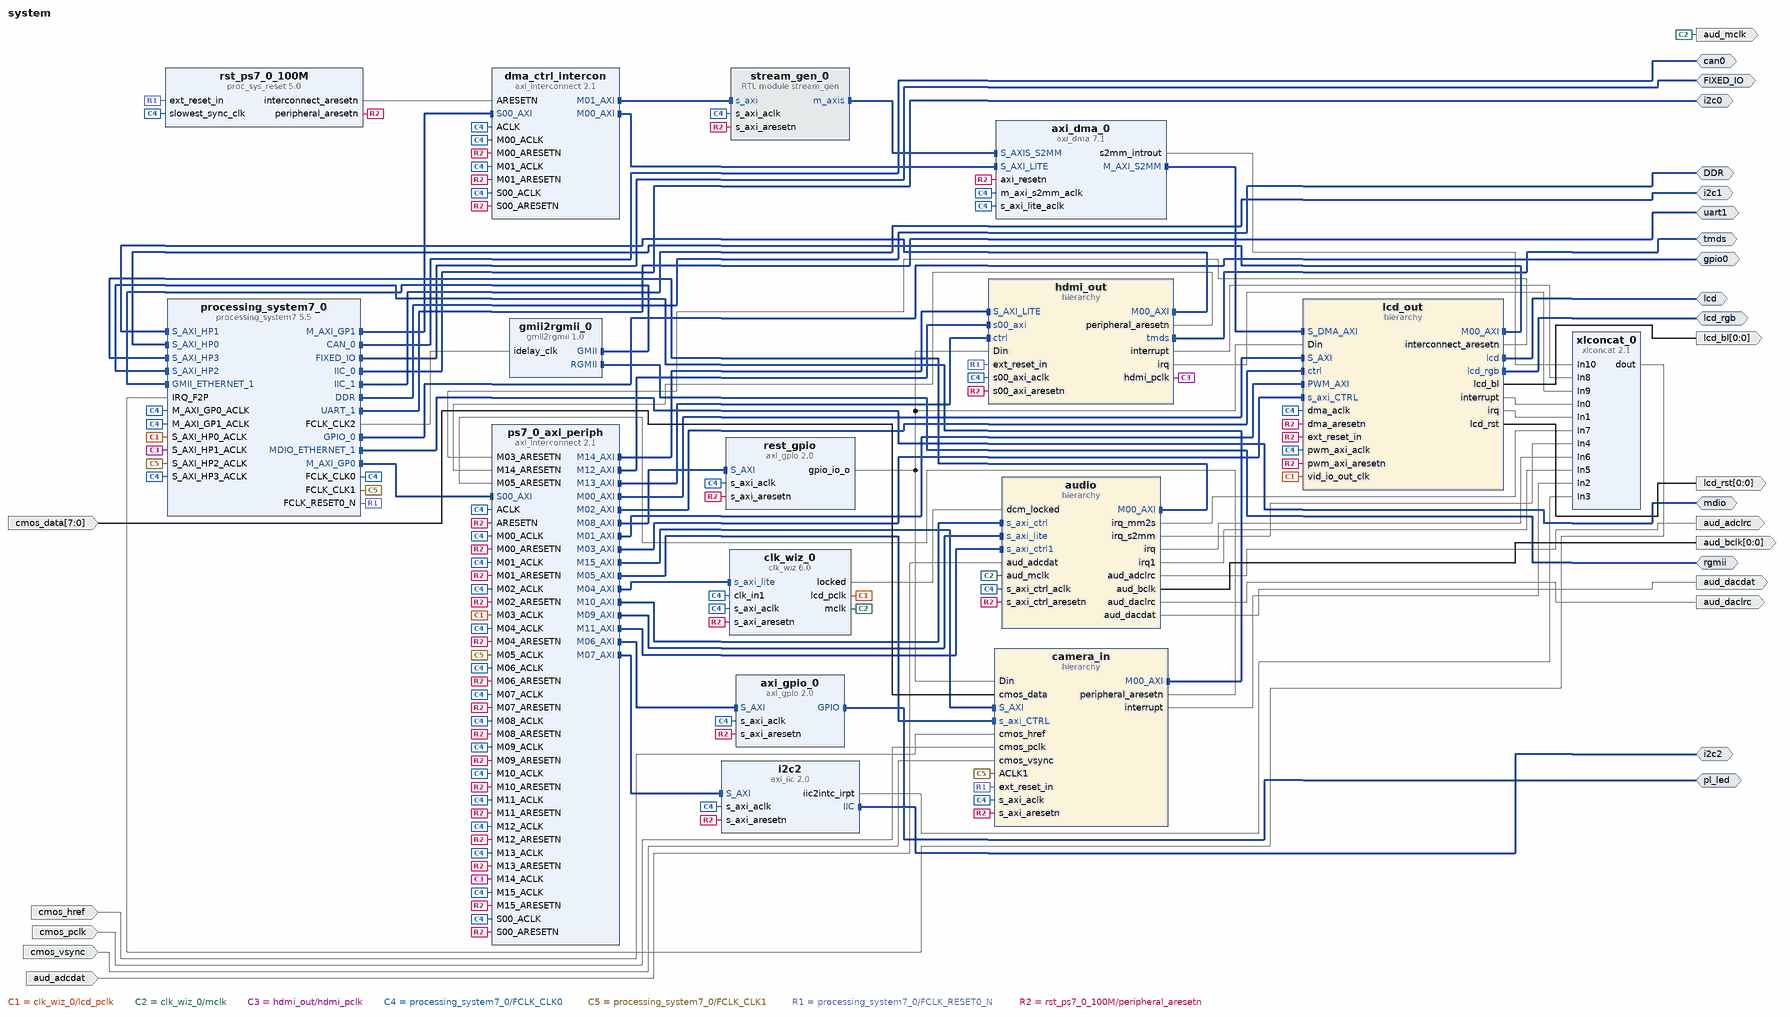
[diagram p0: block diagram of the top level]
# Vivado block design system, xc7z020clg400-2, Vivado 2020.2
create_bd_design system

create_bd_intf_port -mode Master -vlnv xilinx.com:interface:ddrx_rtl:1.0 DDR
create_bd_intf_port -mode Master -vlnv xilinx.com:display_processing_system7:fixedio_rtl:1.0 FIXED_IO
create_bd_intf_port -mode Master -vlnv xilinx.com:interface:can_rtl:1.0 can0
create_bd_intf_port -mode Master -vlnv xilinx.com:interface:gpio_rtl:1.0 gpio0
create_bd_intf_port -mode Master -vlnv xilinx.com:interface:iic_rtl:1.0 i2c0
create_bd_intf_port -mode Master -vlnv xilinx.com:interface:iic_rtl:1.0 i2c1
create_bd_intf_port -mode Master -vlnv xilinx.com:interface:iic_rtl:1.0 i2c2
create_bd_intf_port -mode Master -vlnv xilinx.com:user:lcd_rtl:1.0 lcd
create_bd_intf_port -mode Master -vlnv xilinx.com:interface:gpio_rtl:1.0 lcd_rgb
create_bd_intf_port -mode Master -vlnv xilinx.com:interface:mdio_rtl:1.0 mdio
create_bd_intf_port -mode Master -vlnv xilinx.com:interface:gpio_rtl:1.0 pl_led
create_bd_intf_port -mode Master -vlnv xilinx.com:interface:rgmii_rtl:1.0 rgmii
create_bd_intf_port -mode Master -vlnv openedv.com:user:TMDS_rtl:1.0 tmds
create_bd_intf_port -mode Master -vlnv xilinx.com:interface:uart_rtl:1.0 uart1
create_bd_port -dir I aud_adcdat
create_bd_port -dir O aud_adclrc
create_bd_port -dir O -from 0 -to 0 aud_bclk
create_bd_port -dir O aud_dacdat
create_bd_port -dir O aud_daclrc
create_bd_port -dir I -from 7 -to 0 cmos_data
create_bd_port -dir I cmos_href
create_bd_port -dir I cmos_pclk
create_bd_port -dir I cmos_vsync
create_bd_port -dir O -from 0 -to 0 lcd_bl
create_bd_port -dir O -from 0 -to 0 -type rst lcd_rst
create_bd_port -dir O -type clk aud_mclk

create_bd_cell -type hier audio
create_bd_cell -type ip -vlnv xilinx.com:ip:axi_gpio:2.0 axi_gpio_0
set_property -dict {CONFIG.C_ALL_OUTPUTS 1 CONFIG.C_GPIO_WIDTH 2} [get_bd_cells axi_gpio_0]
create_bd_cell -type hier camera_in
create_bd_cell -type ip -vlnv xilinx.com:ip:clk_wiz:6.0 clk_wiz_0
set_property -dict [list \
  CONFIG.CLKOUT1_DRIVES BUFG \
  CONFIG.CLKOUT1_JITTER 159.843 \
  CONFIG.CLKOUT1_PHASE_ERROR 94.994 \
  CONFIG.CLKOUT1_REQUESTED_OUT_FREQ 33.33333 \
  CONFIG.CLKOUT2_DRIVES BUFG \
  CONFIG.CLKOUT2_JITTER 183.032 \
  CONFIG.CLKOUT2_PHASE_ERROR 94.994 \
  CONFIG.CLKOUT2_REQUESTED_OUT_FREQ 16.9344 \
  CONFIG.CLKOUT2_USED true \
  CONFIG.CLKOUT3_DRIVES BUFG \
  CONFIG.CLKOUT4_DRIVES BUFG \
  CONFIG.CLKOUT5_DRIVES BUFG \
  CONFIG.CLKOUT6_DRIVES BUFG \
  CONFIG.CLKOUT7_DRIVES BUFG \
  CONFIG.CLK_OUT1_PORT lcd_pclk \
  CONFIG.CLK_OUT2_PORT mclk \
  CONFIG.MMCM_CLKFBOUT_MULT_F 10.500 \
  CONFIG.MMCM_CLKOUT0_DIVIDE_F 31.500 \
  CONFIG.MMCM_CLKOUT1_DIVIDE 62 \
  CONFIG.MMCM_DIVCLK_DIVIDE 1 \
  CONFIG.NUM_OUT_CLKS 2 \
  CONFIG.SECONDARY_SOURCE Single_ended_clock_capable_pin \
  CONFIG.USE_DYN_RECONFIG true \
  CONFIG.USE_PHASE_ALIGNMENT false \
] [get_bd_cells clk_wiz_0]
create_bd_cell -type ip -vlnv xilinx.com:user:gmii2rgmii:1.0 gmii2rgmii_0
create_bd_cell -type hier hdmi_out
create_bd_cell -type ip -vlnv xilinx.com:ip:axi_iic:2.0 i2c2
create_bd_cell -type hier lcd_out
create_bd_cell -type ip -vlnv xilinx.com:ip:processing_system7:5.5 processing_system7_0
set_property -dict [list \
  CONFIG.PCW_APU_PERIPHERAL_FREQMHZ 767.0 \
  CONFIG.PCW_CAN0_CAN0_IO EMIO \
  CONFIG.PCW_CAN0_PERIPHERAL_ENABLE 1 \
  CONFIG.PCW_ENET0_ENET0_IO {MIO 16 .. 27} \
  CONFIG.PCW_ENET0_GRP_MDIO_ENABLE 1 \
  CONFIG.PCW_ENET0_GRP_MDIO_IO {MIO 52 .. 53} \
  CONFIG.PCW_ENET0_PERIPHERAL_ENABLE 1 \
  CONFIG.PCW_ENET1_ENET1_IO EMIO \
  CONFIG.PCW_ENET1_GRP_MDIO_ENABLE 1 \
  CONFIG.PCW_ENET1_GRP_MDIO_IO EMIO \
  CONFIG.PCW_ENET1_PERIPHERAL_ENABLE 1 \
  CONFIG.PCW_ENET_RESET_ENABLE 0 \
  CONFIG.PCW_EN_CLK1_PORT 1 \
  CONFIG.PCW_EN_CLK2_PORT 1 \
  CONFIG.PCW_EN_CLK3_PORT 1 \
  CONFIG.PCW_FCLK1_PERIPHERAL_CLKSRC {ARM PLL} \
  CONFIG.PCW_FCLK3_PERIPHERAL_CLKSRC {ARM PLL} \
  CONFIG.PCW_FCLK_CLK1_BUF TRUE \
  CONFIG.PCW_FCLK_CLK2_BUF TRUE \
  CONFIG.PCW_FCLK_CLK3_BUF TRUE \
  CONFIG.PCW_FPGA0_PERIPHERAL_FREQMHZ 100.0 \
  CONFIG.PCW_FPGA1_PERIPHERAL_FREQMHZ 150 \
  CONFIG.PCW_FPGA2_PERIPHERAL_FREQMHZ 200.0 \
  CONFIG.PCW_FPGA3_PERIPHERAL_FREQMHZ 12 \
  CONFIG.PCW_FPGA_FCLK1_ENABLE 1 \
  CONFIG.PCW_FPGA_FCLK2_ENABLE 1 \
  CONFIG.PCW_FPGA_FCLK3_ENABLE 1 \
  CONFIG.PCW_GPIO_EMIO_GPIO_ENABLE 1 \
  CONFIG.PCW_GPIO_EMIO_GPIO_IO 11 \
  CONFIG.PCW_GPIO_EMIO_GPIO_WIDTH 11 \
  CONFIG.PCW_GPIO_MIO_GPIO_ENABLE 1 \
  CONFIG.PCW_GPIO_MIO_GPIO_IO MIO \
  CONFIG.PCW_I2C0_I2C0_IO EMIO \
  CONFIG.PCW_I2C0_PERIPHERAL_ENABLE 1 \
  CONFIG.PCW_I2C1_I2C1_IO EMIO \
  CONFIG.PCW_I2C1_PERIPHERAL_ENABLE 1 \
  CONFIG.PCW_I2C_PERIPHERAL_FREQMHZ 127.777779 \
  CONFIG.PCW_I2C_RESET_ENABLE 0 \
  CONFIG.PCW_IRQ_F2P_INTR 1 \
  CONFIG.PCW_PRESET_BANK1_VOLTAGE {LVCMOS 1.8V} \
  CONFIG.PCW_QSPI_GRP_SINGLE_SS_ENABLE 1 \
  CONFIG.PCW_QSPI_GRP_SINGLE_SS_IO {MIO 1 .. 6} \
  CONFIG.PCW_QSPI_PERIPHERAL_ENABLE 1 \
  CONFIG.PCW_QSPI_QSPI_IO {MIO 1 .. 6} \
  CONFIG.PCW_SD0_GRP_CD_ENABLE 1 \
  CONFIG.PCW_SD0_GRP_CD_IO {MIO 10} \
  CONFIG.PCW_SD0_GRP_WP_ENABLE 0 \
  CONFIG.PCW_SD0_PERIPHERAL_ENABLE 1 \
  CONFIG.PCW_SD0_SD0_IO {MIO 40 .. 45} \
  CONFIG.PCW_SD1_PERIPHERAL_ENABLE 1 \
  CONFIG.PCW_SD1_SD1_IO {MIO 46 .. 51} \
  CONFIG.PCW_SDIO_PERIPHERAL_FREQMHZ 100 \
  CONFIG.PCW_SINGLE_QSPI_DATA_MODE x4 \
  CONFIG.PCW_UART0_PERIPHERAL_ENABLE 1 \
  CONFIG.PCW_UART0_UART0_IO {MIO 14 .. 15} \
  CONFIG.PCW_UART1_PERIPHERAL_ENABLE 1 \
  CONFIG.PCW_UART1_UART1_IO EMIO \
  CONFIG.PCW_UART_PERIPHERAL_FREQMHZ 100 \
  CONFIG.PCW_UIPARAM_DDR_MEMORY_TYPE {DDR 3 (Low Voltage)} \
  CONFIG.PCW_UIPARAM_DDR_PARTNO {MT41K256M16 RE-125} \
  CONFIG.PCW_USB0_PERIPHERAL_ENABLE 1 \
  CONFIG.PCW_USB0_RESET_ENABLE 1 \
  CONFIG.PCW_USB0_RESET_IO {MIO 9} \
  CONFIG.PCW_USB0_USB0_IO {MIO 28 .. 39} \
  CONFIG.PCW_USB_RESET_ENABLE 1 \
  CONFIG.PCW_USB_RESET_SELECT {Share reset pin} \
  CONFIG.PCW_USE_FABRIC_INTERRUPT 1 \
  CONFIG.PCW_USE_M_AXI_GP1 1 \
  CONFIG.PCW_USE_S_AXI_HP0 1 \
  CONFIG.PCW_USE_S_AXI_HP1 1 \
  CONFIG.PCW_USE_S_AXI_HP2 1 \
  CONFIG.PCW_USE_S_AXI_HP3 1 \
] [get_bd_cells processing_system7_0]
# 230 more settings of processing_system7_0 are not shown: defaults, MIO pin electricals, DDR timing, and values the tool derives
create_bd_cell -type ip -vlnv xilinx.com:ip:axi_interconnect:2.1 ps7_0_axi_periph
set_property -dict {CONFIG.NUM_MI 16} [get_bd_cells ps7_0_axi_periph]
create_bd_cell -type ip -vlnv xilinx.com:ip:axi_gpio:2.0 rest_gpio
set_property -dict {CONFIG.C_ALL_OUTPUTS 1 CONFIG.C_GPIO_WIDTH 3} [get_bd_cells rest_gpio]
create_bd_cell -type ip -vlnv xilinx.com:ip:proc_sys_reset:5.0 rst_ps7_0_100M
create_bd_cell -type ip -vlnv xilinx.com:ip:xlconcat:2.1 xlconcat_0
set_property -dict {CONFIG.NUM_PORTS 11} [get_bd_cells xlconcat_0]
create_bd_cell -type module -reference stream_gen stream_gen_0
create_bd_cell -type ip -vlnv xilinx.com:ip:axi_dma:7.1 axi_dma_0
set_property -dict [list \
  CONFIG.c_include_mm2s 0 \
  CONFIG.c_include_s2mm 1 \
  CONFIG.c_include_sg 0 \
  CONFIG.c_sg_length_width 23 \
] [get_bd_cells axi_dma_0]
create_bd_cell -type ip -vlnv xilinx.com:ip:axi_interconnect:2.1 dma_ctrl_intercon
set_property -dict {CONFIG.NUM_MI 2 CONFIG.NUM_SI 1} [get_bd_cells dma_ctrl_intercon]

# ---- hierarchy /audio ----
current_bd_instance /audio
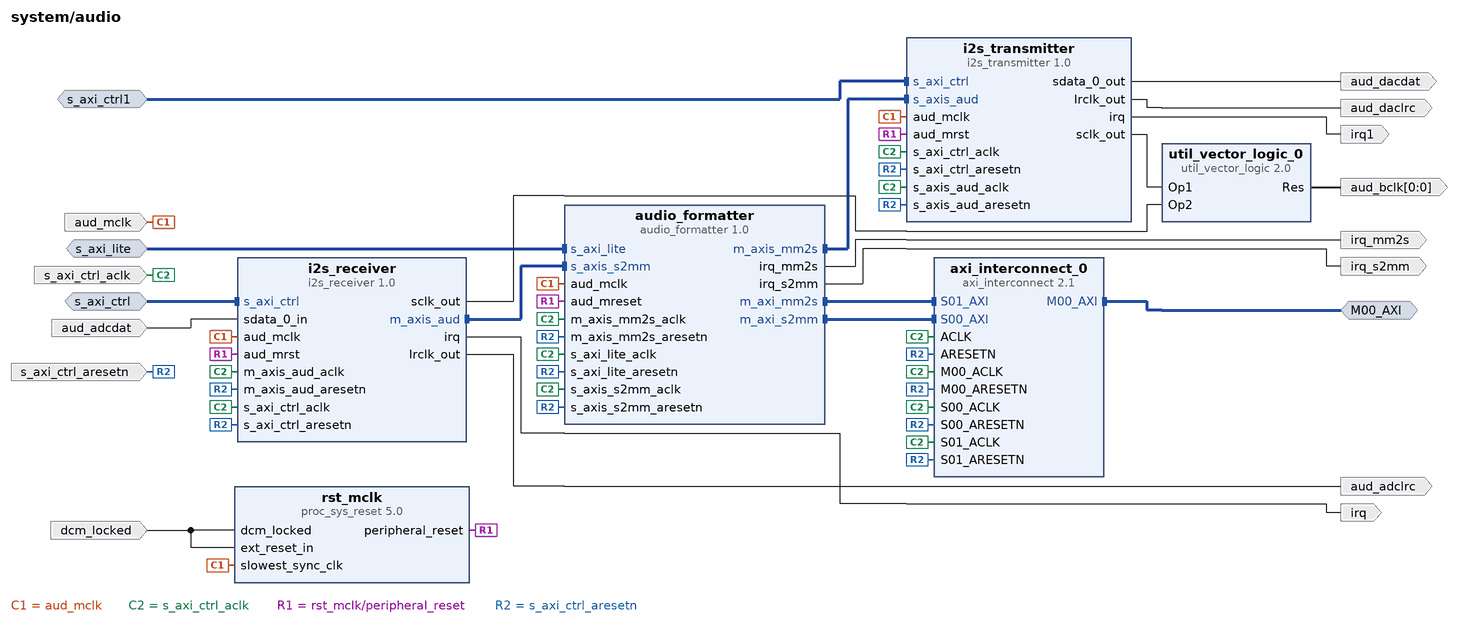
[diagram p1: block diagram inside /audio]
create_bd_intf_pin -mode Master -vlnv xilinx.com:interface:aximm_rtl:1.0 M00_AXI
create_bd_intf_pin -mode Slave -vlnv xilinx.com:interface:aximm_rtl:1.0 s_axi_ctrl
create_bd_intf_pin -mode Slave -vlnv xilinx.com:interface:aximm_rtl:1.0 s_axi_ctrl1
create_bd_intf_pin -mode Slave -vlnv xilinx.com:interface:aximm_rtl:1.0 s_axi_lite
create_bd_pin -dir I aud_adcdat
create_bd_pin -dir O aud_adclrc
create_bd_pin -dir O -from 0 -to 0 aud_bclk
create_bd_pin -dir O aud_dacdat
create_bd_pin -dir O aud_daclrc
create_bd_pin -dir I -type clk aud_mclk
create_bd_pin -dir I dcm_locked
create_bd_pin -dir O -type intr irq
create_bd_pin -dir O -type intr irq1
create_bd_pin -dir O -type intr irq_mm2s
create_bd_pin -dir O -type intr irq_s2mm
create_bd_pin -dir I -type clk s_axi_ctrl_aclk
create_bd_pin -dir I -type rst s_axi_ctrl_aresetn

create_bd_cell -type ip -vlnv xilinx.com:ip:audio_formatter:1.0 audio_formatter
set_property -dict [list \
  CONFIG.C_MM2S_ADDR_WIDTH 32 \
  CONFIG.C_MM2S_ASYNC_CLOCK 0 \
  CONFIG.C_S2MM_ADDR_WIDTH 32 \
  CONFIG.C_S2MM_ASYNC_CLOCK 0 \
] [get_bd_cells audio_formatter]
create_bd_cell -type ip -vlnv xilinx.com:ip:axi_interconnect:2.1 axi_interconnect_0
set_property -dict {CONFIG.NUM_MI 1 CONFIG.NUM_SI 2} [get_bd_cells axi_interconnect_0]
create_bd_cell -type ip -vlnv xilinx.com:ip:i2s_receiver:1.0 i2s_receiver
create_bd_cell -type ip -vlnv xilinx.com:ip:i2s_transmitter:1.0 i2s_transmitter
create_bd_cell -type ip -vlnv xilinx.com:ip:proc_sys_reset:5.0 rst_mclk
create_bd_cell -type ip -vlnv xilinx.com:ip:util_vector_logic:2.0 util_vector_logic_0
set_property -dict {CONFIG.C_OPERATION or CONFIG.C_SIZE 1} [get_bd_cells util_vector_logic_0]

# ---- hierarchy /camera_in ----
current_bd_instance /camera_in
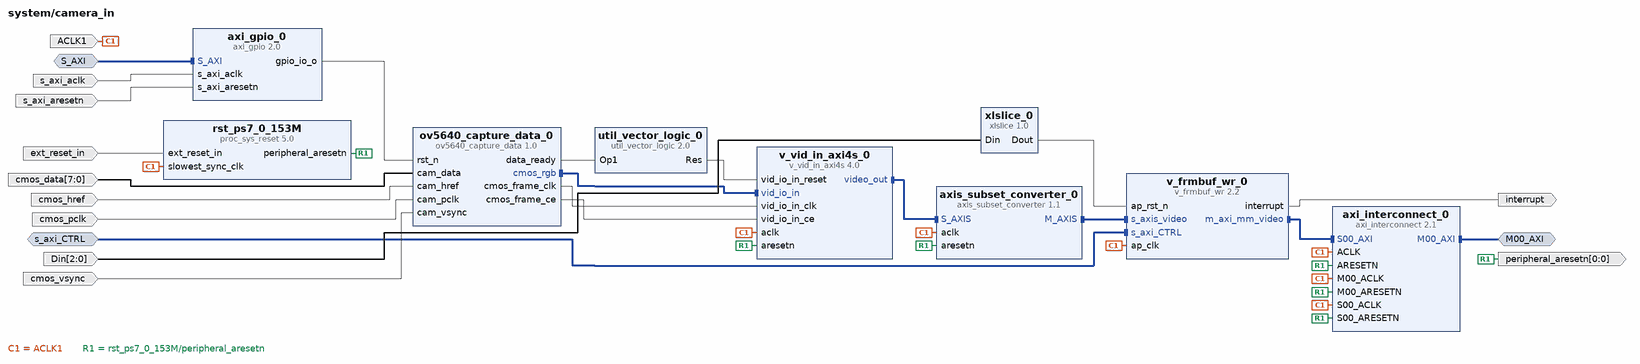
[diagram p2: block diagram inside /camera_in]
create_bd_intf_pin -mode Master -vlnv xilinx.com:interface:aximm_rtl:1.0 M00_AXI
create_bd_intf_pin -mode Slave -vlnv xilinx.com:interface:aximm_rtl:1.0 s_axi_CTRL
create_bd_intf_pin -mode Slave -vlnv xilinx.com:interface:aximm_rtl:1.0 S_AXI
create_bd_pin -dir I -type clk ACLK1
create_bd_pin -dir I -from 2 -to 0 Din
create_bd_pin -dir I -from 7 -to 0 cmos_data
create_bd_pin -dir I cmos_href
create_bd_pin -dir I cmos_pclk
create_bd_pin -dir I cmos_vsync
create_bd_pin -dir I -type rst ext_reset_in
create_bd_pin -dir O -type intr interrupt
create_bd_pin -dir O -from 0 -to 0 -type rst peripheral_aresetn
create_bd_pin -dir I -type clk s_axi_aclk
create_bd_pin -dir I -type rst s_axi_aresetn

create_bd_cell -type ip -vlnv xilinx.com:ip:axi_interconnect:2.1 axi_interconnect_0
set_property -dict {CONFIG.NUM_MI 1 CONFIG.S00_HAS_DATA_FIFO 2 CONFIG.S00_HAS_REGSLICE 4} [get_bd_cells axi_interconnect_0]
create_bd_cell -type ip -vlnv xilinx.com:ip:proc_sys_reset:5.0 rst_ps7_0_153M
create_bd_cell -type ip -vlnv xilinx.com:ip:v_frmbuf_wr:2.2 v_frmbuf_wr_0
set_property -dict [list \
  CONFIG.HAS_BGR8 1 \
  CONFIG.MAX_COLS 1920 \
  CONFIG.MAX_ROWS 1080 \
  CONFIG.SAMPLES_PER_CLOCK 1 \
] [get_bd_cells v_frmbuf_wr_0]
create_bd_cell -type ip -vlnv xilinx.com:ip:v_vid_in_axi4s:4.0 v_vid_in_axi4s_0
set_property -dict {CONFIG.C_ADDR_WIDTH 11 CONFIG.C_HAS_ASYNC_CLK 1} [get_bd_cells v_vid_in_axi4s_0]
create_bd_cell -type ip -vlnv xilinx.com:ip:xlslice:1.0 xlslice_0
set_property -dict {CONFIG.DIN_FROM 1 CONFIG.DIN_TO 1 CONFIG.DIN_WIDTH 3} [get_bd_cells xlslice_0]
create_bd_cell -type ip -vlnv xilinx.com:ip:axis_subset_converter:1.1 axis_subset_converter_0
set_property -dict [list \
  CONFIG.M_TDATA_NUM_BYTES 3 \
  CONFIG.S_TDATA_NUM_BYTES 3 \
  CONFIG.TDATA_REMAP {tdata[7:0],tdata[23:16],tdata[15:8]} \
] [get_bd_cells axis_subset_converter_0]
create_bd_cell -type ip -vlnv xilinx.com:ip:axi_gpio:2.0 axi_gpio_0
set_property -dict [list \
  CONFIG.C_ALL_INPUTS 0 \
  CONFIG.C_ALL_OUTPUTS 1 \
  CONFIG.C_GPIO_WIDTH 1 \
  CONFIG.C_IS_DUAL 0 \
] [get_bd_cells axi_gpio_0]
create_bd_cell -type ip -vlnv alientek.com:user:ov5640_capture_data:1.0 ov5640_capture_data_0
create_bd_cell -type ip -vlnv xilinx.com:ip:util_vector_logic:2.0 util_vector_logic_0
set_property -dict {CONFIG.C_OPERATION not CONFIG.C_SIZE 1} [get_bd_cells util_vector_logic_0]

# ---- hierarchy /hdmi_out ----
current_bd_instance /hdmi_out
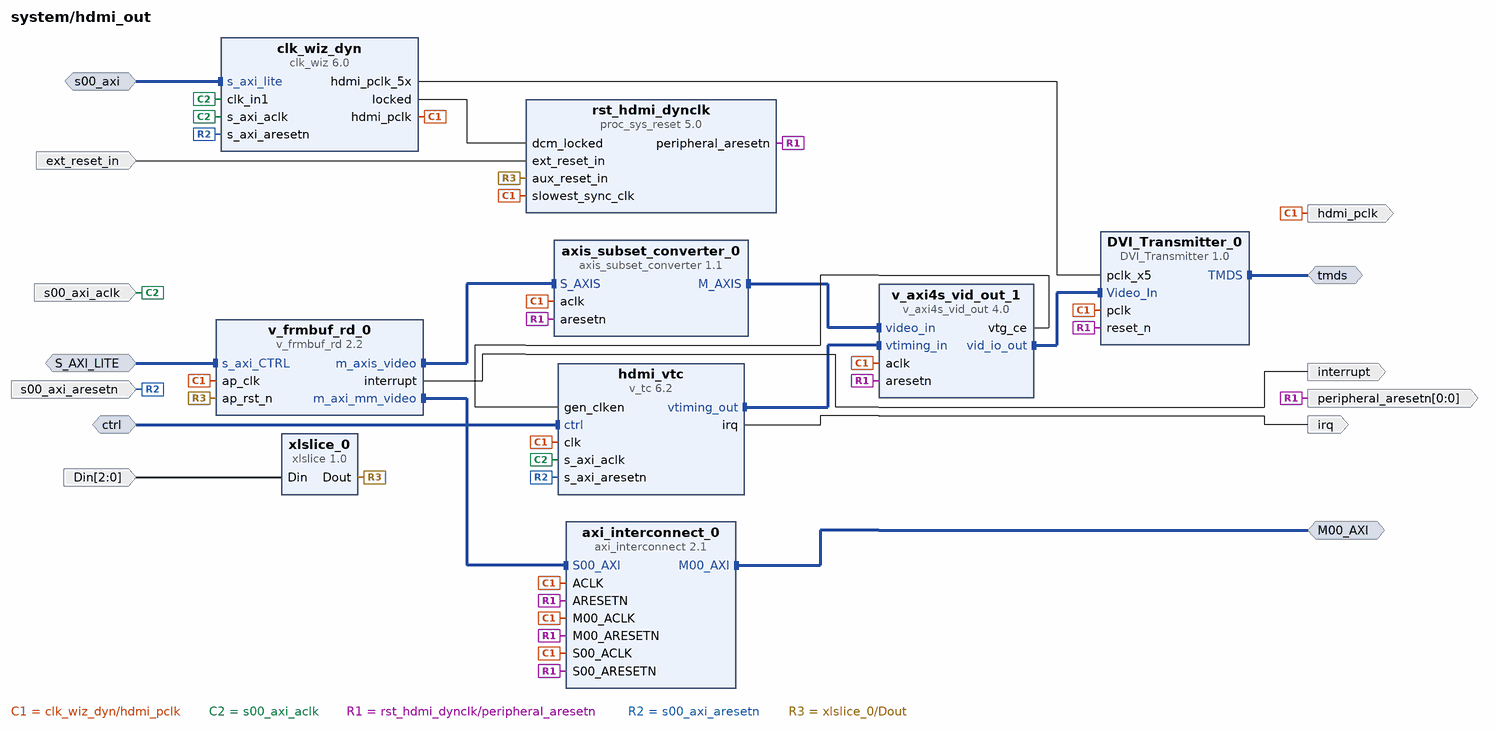
[diagram p3: block diagram inside /hdmi_out]
create_bd_intf_pin -mode Master -vlnv xilinx.com:interface:aximm_rtl:1.0 M00_AXI
create_bd_intf_pin -mode Slave -vlnv xilinx.com:interface:aximm_rtl:1.0 S_AXI_LITE
create_bd_intf_pin -mode Slave -vlnv xilinx.com:interface:aximm_rtl:1.0 ctrl
create_bd_intf_pin -mode Slave -vlnv xilinx.com:interface:aximm_rtl:1.0 s00_axi
create_bd_intf_pin -mode Master -vlnv openedv.com:user:TMDS_rtl:1.0 tmds
create_bd_pin -dir I -from 2 -to 0 Din
create_bd_pin -dir I -type rst ext_reset_in
create_bd_pin -dir O -type clk hdmi_pclk
create_bd_pin -dir O -type intr interrupt
create_bd_pin -dir O -type intr irq
create_bd_pin -dir O -from 0 -to 0 -type rst peripheral_aresetn
create_bd_pin -dir I -type clk s00_axi_aclk
create_bd_pin -dir I -type rst s00_axi_aresetn

create_bd_cell -type ip -vlnv openedv.com:user:DVI_Transmitter:1.0 DVI_Transmitter_0
create_bd_cell -type ip -vlnv xilinx.com:ip:axi_interconnect:2.1 axi_interconnect_0
set_property -dict [list \
  CONFIG.ENABLE_ADVANCED_OPTIONS 0 \
  CONFIG.NUM_MI 1 \
  CONFIG.S00_HAS_DATA_FIFO 0 \
  CONFIG.S00_HAS_REGSLICE 0 \
] [get_bd_cells axi_interconnect_0]
create_bd_cell -type ip -vlnv xilinx.com:ip:axis_subset_converter:1.1 axis_subset_converter_0
set_property -dict [list \
  CONFIG.M_TDATA_NUM_BYTES 3 \
  CONFIG.S_TDATA_NUM_BYTES 3 \
  CONFIG.TDATA_REMAP {tdata[15:8],tdata[7:0],tdata[23:16]} \
] [get_bd_cells axis_subset_converter_0]
create_bd_cell -type ip -vlnv xilinx.com:ip:clk_wiz:6.0 clk_wiz_dyn
set_property -dict [list \
  CONFIG.CLKOUT1_DRIVES BUFG \
  CONFIG.CLKOUT1_JITTER 298.245 \
  CONFIG.CLKOUT1_PHASE_ERROR 322.999 \
  CONFIG.CLKOUT1_REQUESTED_OUT_FREQ 148.5 \
  CONFIG.CLKOUT2_DRIVES No_buffer \
  CONFIG.CLKOUT2_JITTER 232.529 \
  CONFIG.CLKOUT2_PHASE_ERROR 322.999 \
  CONFIG.CLKOUT2_REQUESTED_OUT_FREQ 742.5 \
  CONFIG.CLKOUT2_USED true \
  CONFIG.CLKOUT3_DRIVES BUFG \
  CONFIG.CLKOUT4_DRIVES BUFG \
  CONFIG.CLKOUT5_DRIVES BUFG \
  CONFIG.CLKOUT6_DRIVES BUFG \
  CONFIG.CLKOUT7_DRIVES BUFG \
  CONFIG.CLK_OUT1_PORT hdmi_pclk \
  CONFIG.CLK_OUT2_PORT hdmi_pclk_5x \
  CONFIG.FEEDBACK_SOURCE FDBK_AUTO \
  CONFIG.MMCM_CLKFBOUT_MULT_F 37.125 \
  CONFIG.MMCM_CLKOUT0_DIVIDE_F 5.000 \
  CONFIG.MMCM_CLKOUT1_DIVIDE 1 \
  CONFIG.MMCM_DIVCLK_DIVIDE 5 \
  CONFIG.NUM_OUT_CLKS 2 \
  CONFIG.SECONDARY_SOURCE Single_ended_clock_capable_pin \
  CONFIG.USE_DYN_RECONFIG true \
  CONFIG.USE_PHASE_ALIGNMENT false \
] [get_bd_cells clk_wiz_dyn]
create_bd_cell -type ip -vlnv xilinx.com:ip:v_tc:6.2 hdmi_vtc
set_property -dict [list \
  CONFIG.VIDEO_MODE 1080p \
  CONFIG.enable_detection false \
  CONFIG.max_clocks_per_line 4096 \
  CONFIG.max_lines_per_frame 2048 \
] [get_bd_cells hdmi_vtc]
create_bd_cell -type ip -vlnv xilinx.com:ip:proc_sys_reset:5.0 rst_hdmi_dynclk
create_bd_cell -type ip -vlnv xilinx.com:ip:v_axi4s_vid_out:4.0 v_axi4s_vid_out_1
set_property -dict {CONFIG.C_ADDR_WIDTH 11 CONFIG.C_HAS_ASYNC_CLK 0} [get_bd_cells v_axi4s_vid_out_1]
create_bd_cell -type ip -vlnv xilinx.com:ip:v_frmbuf_rd:2.2 v_frmbuf_rd_0
set_property -dict [list \
  CONFIG.HAS_BGR8 1 \
  CONFIG.MAX_COLS 1920 \
  CONFIG.MAX_ROWS 1080 \
  CONFIG.SAMPLES_PER_CLOCK 1 \
] [get_bd_cells v_frmbuf_rd_0]
create_bd_cell -type ip -vlnv xilinx.com:ip:xlslice:1.0 xlslice_0
set_property -dict {CONFIG.DIN_FROM 2 CONFIG.DIN_TO 2 CONFIG.DIN_WIDTH 3} [get_bd_cells xlslice_0]

# ---- hierarchy /lcd_out ----
current_bd_instance /lcd_out
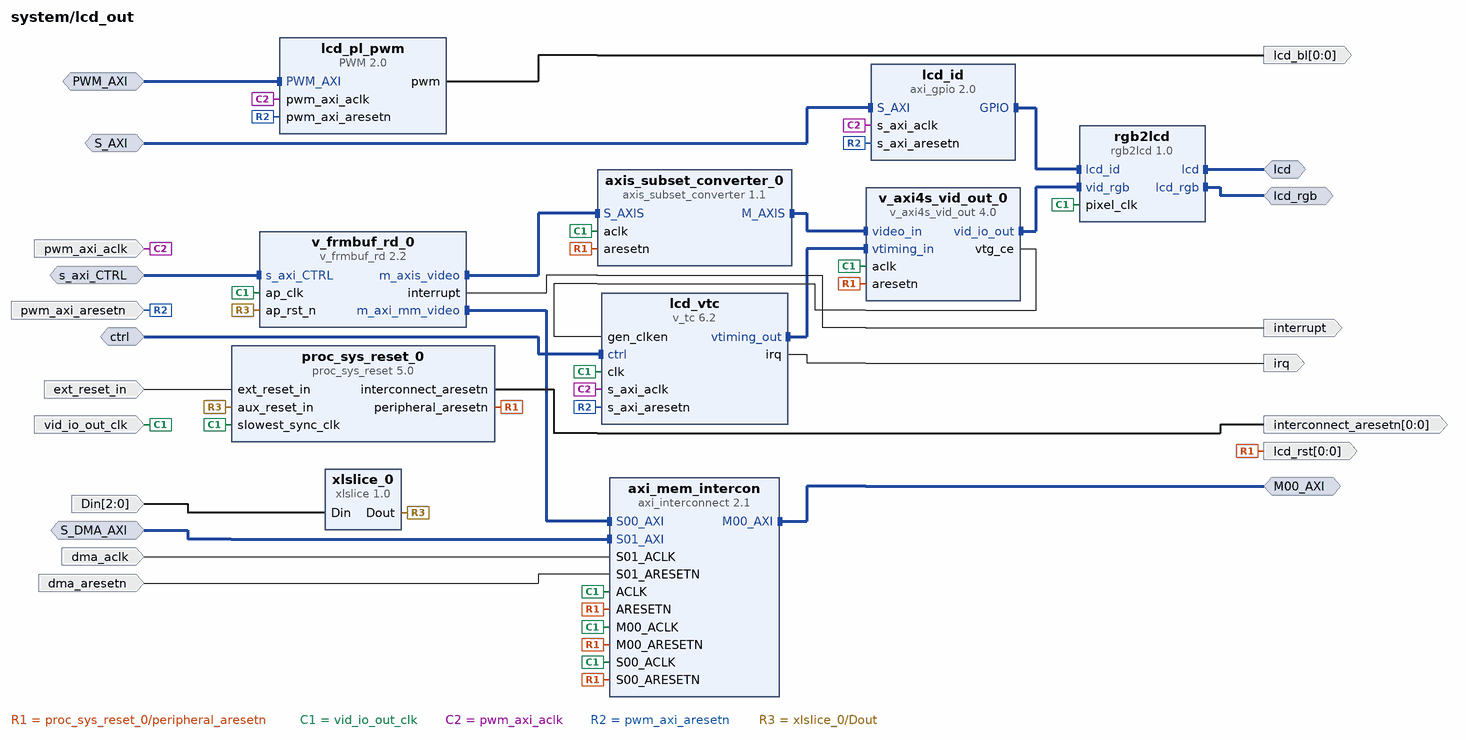
[diagram p4: block diagram inside /lcd_out]
create_bd_intf_pin -mode Master -vlnv xilinx.com:interface:aximm_rtl:1.0 M00_AXI
create_bd_intf_pin -mode Slave -vlnv xilinx.com:interface:aximm_rtl:1.0 PWM_AXI
create_bd_intf_pin -mode Slave -vlnv xilinx.com:interface:aximm_rtl:1.0 S_AXI
create_bd_intf_pin -mode Slave -vlnv xilinx.com:interface:aximm_rtl:1.0 ctrl
create_bd_intf_pin -mode Master -vlnv xilinx.com:user:lcd_rtl:1.0 lcd
create_bd_intf_pin -mode Master -vlnv xilinx.com:interface:gpio_rtl:1.0 lcd_rgb
create_bd_intf_pin -mode Slave -vlnv xilinx.com:interface:aximm_rtl:1.0 s_axi_CTRL
create_bd_intf_pin -mode Slave -vlnv xilinx.com:interface:aximm_rtl:1.0 S_DMA_AXI
create_bd_pin -dir I -from 2 -to 0 Din
create_bd_pin -dir I -type rst ext_reset_in
create_bd_pin -dir O -from 0 -to 0 -type rst interconnect_aresetn
create_bd_pin -dir O -type intr interrupt
create_bd_pin -dir O -type intr irq
create_bd_pin -dir O -from 0 -to 0 lcd_bl
create_bd_pin -dir O -from 0 -to 0 -type rst lcd_rst
create_bd_pin -dir I -type clk pwm_axi_aclk
create_bd_pin -dir I -type rst pwm_axi_aresetn
create_bd_pin -dir I -type clk vid_io_out_clk
create_bd_pin -dir I -type clk dma_aclk
create_bd_pin -dir I -type rst dma_aresetn

create_bd_cell -type ip -vlnv xilinx.com:ip:axi_interconnect:2.1 axi_mem_intercon
set_property -dict {CONFIG.NUM_MI 1 CONFIG.NUM_SI 2} [get_bd_cells axi_mem_intercon]
create_bd_cell -type ip -vlnv xilinx.com:ip:axi_gpio:2.0 lcd_id
set_property -dict {CONFIG.C_GPIO_WIDTH 3} [get_bd_cells lcd_id]
create_bd_cell -type ip -vlnv digilentinc.com:IP:PWM:2.0 lcd_pl_pwm
create_bd_cell -type ip -vlnv xilinx.com:ip:v_tc:6.2 lcd_vtc
set_property -dict [list \
  CONFIG.enable_detection false \
  CONFIG.max_clocks_per_line 2048 \
  CONFIG.max_lines_per_frame 2048 \
] [get_bd_cells lcd_vtc]
create_bd_cell -type ip -vlnv xilinx.com:ip:proc_sys_reset:5.0 proc_sys_reset_0
create_bd_cell -type ip -vlnv www.alientek.com:user:rgb2lcd:1.0 rgb2lcd
create_bd_cell -type ip -vlnv xilinx.com:ip:v_axi4s_vid_out:4.0 v_axi4s_vid_out_0
set_property -dict {CONFIG.C_ADDR_WIDTH 10 CONFIG.C_HAS_ASYNC_CLK 0} [get_bd_cells v_axi4s_vid_out_0]
create_bd_cell -type ip -vlnv xilinx.com:ip:v_frmbuf_rd:2.2 v_frmbuf_rd_0
set_property -dict [list \
  CONFIG.HAS_BGR8 1 \
  CONFIG.MAX_COLS 1920 \
  CONFIG.MAX_ROWS 1080 \
  CONFIG.SAMPLES_PER_CLOCK 1 \
] [get_bd_cells v_frmbuf_rd_0]
create_bd_cell -type ip -vlnv xilinx.com:ip:xlslice:1.0 xlslice_0
set_property -dict {CONFIG.DIN_WIDTH 3} [get_bd_cells xlslice_0]
create_bd_cell -type ip -vlnv xilinx.com:ip:axis_subset_converter:1.1 axis_subset_converter_0
set_property -dict [list \
  CONFIG.M_TDATA_NUM_BYTES 3 \
  CONFIG.S_TDATA_NUM_BYTES 3 \
  CONFIG.TDATA_REMAP {tdata[15:8],tdata[7:0],tdata[23:16]} \
] [get_bd_cells axis_subset_converter_0]

# ---- connections ----

current_bd_instance /audio
connect_bd_intf_net [get_bd_intf_pins M00_AXI] [get_bd_intf_pins axi_interconnect_0/M00_AXI]
connect_bd_intf_net [get_bd_intf_pins audio_formatter/s_axis_s2mm] [get_bd_intf_pins i2s_receiver/m_axis_aud]
connect_bd_intf_net [get_bd_intf_pins s_axi_ctrl1] [get_bd_intf_pins i2s_transmitter/s_axi_ctrl]
connect_bd_intf_net [get_bd_intf_pins s_axi_ctrl] [get_bd_intf_pins i2s_receiver/s_axi_ctrl]
connect_bd_intf_net [get_bd_intf_pins audio_formatter/m_axis_mm2s] [get_bd_intf_pins i2s_transmitter/s_axis_aud]
connect_bd_intf_net [get_bd_intf_pins audio_formatter/m_axi_mm2s] [get_bd_intf_pins axi_interconnect_0/S01_AXI]
connect_bd_intf_net [get_bd_intf_pins audio_formatter/m_axi_s2mm] [get_bd_intf_pins axi_interconnect_0/S00_AXI]
connect_bd_intf_net [get_bd_intf_pins s_axi_lite] [get_bd_intf_pins audio_formatter/s_axi_lite]
connect_bd_net [get_bd_pins audio_formatter/irq_mm2s] [get_bd_pins irq_mm2s]
connect_bd_net [get_bd_pins audio_formatter/irq_s2mm] [get_bd_pins irq_s2mm]
connect_bd_net -net clk_wiz_0_clk_out2 [get_bd_pins aud_mclk] \
  [get_bd_pins audio_formatter/aud_mclk] [get_bd_pins i2s_receiver/aud_mclk] [get_bd_pins i2s_transmitter/aud_mclk] \
  [get_bd_pins rst_mclk/slowest_sync_clk]
connect_bd_net [get_bd_pins dcm_locked] [get_bd_pins rst_mclk/dcm_locked] [get_bd_pins rst_mclk/ext_reset_in]
connect_bd_net [get_bd_pins i2s_receiver/irq] [get_bd_pins irq]
connect_bd_net [get_bd_pins i2s_receiver/lrclk_out] [get_bd_pins aud_adclrc]
connect_bd_net [get_bd_pins i2s_transmitter/irq] [get_bd_pins irq1]
connect_bd_net [get_bd_pins i2s_transmitter/lrclk_out] [get_bd_pins aud_daclrc]
connect_bd_net [get_bd_pins i2s_transmitter/sdata_0_out] [get_bd_pins aud_dacdat]
connect_bd_net -net processing_system7_0_FCLK_CLK0 [get_bd_pins s_axi_ctrl_aclk] \
  [get_bd_pins audio_formatter/m_axis_mm2s_aclk] [get_bd_pins audio_formatter/s_axi_lite_aclk] \
  [get_bd_pins audio_formatter/s_axis_s2mm_aclk] [get_bd_pins axi_interconnect_0/ACLK] \
  [get_bd_pins axi_interconnect_0/M00_ACLK] [get_bd_pins axi_interconnect_0/S00_ACLK] \
  [get_bd_pins axi_interconnect_0/S01_ACLK] [get_bd_pins i2s_receiver/m_axis_aud_aclk] \
  [get_bd_pins i2s_receiver/s_axi_ctrl_aclk] [get_bd_pins i2s_transmitter/s_axi_ctrl_aclk] \
  [get_bd_pins i2s_transmitter/s_axis_aud_aclk]
connect_bd_net -net rst_clk_wiz_0_16M_peripheral_reset [get_bd_pins rst_mclk/peripheral_reset] \
  [get_bd_pins audio_formatter/aud_mreset] [get_bd_pins i2s_receiver/aud_mrst] [get_bd_pins i2s_transmitter/aud_mrst]
connect_bd_net -net rst_ps7_0_100M_peripheral_aresetn [get_bd_pins s_axi_ctrl_aresetn] \
  [get_bd_pins audio_formatter/m_axis_mm2s_aresetn] [get_bd_pins audio_formatter/s_axi_lite_aresetn] \
  [get_bd_pins audio_formatter/s_axis_s2mm_aresetn] [get_bd_pins axi_interconnect_0/ARESETN] \
  [get_bd_pins axi_interconnect_0/M00_ARESETN] [get_bd_pins axi_interconnect_0/S00_ARESETN] \
  [get_bd_pins axi_interconnect_0/S01_ARESETN] [get_bd_pins i2s_receiver/m_axis_aud_aresetn] \
  [get_bd_pins i2s_receiver/s_axi_ctrl_aresetn] [get_bd_pins i2s_transmitter/s_axi_ctrl_aresetn] \
  [get_bd_pins i2s_transmitter/s_axis_aud_aresetn]
connect_bd_net -net sdata_0_in_0_1 [get_bd_pins aud_adcdat] [get_bd_pins i2s_receiver/sdata_0_in]
connect_bd_net [get_bd_pins i2s_transmitter/sclk_out] [get_bd_pins util_vector_logic_0/Op1]
connect_bd_net [get_bd_pins i2s_receiver/sclk_out] [get_bd_pins util_vector_logic_0/Op2]
connect_bd_net [get_bd_pins util_vector_logic_0/Res] [get_bd_pins aud_bclk]

current_bd_instance /camera_in
connect_bd_intf_net [get_bd_intf_pins ov5640_capture_data_0/cmos_rgb] [get_bd_intf_pins v_vid_in_axi4s_0/vid_io_in]
connect_bd_intf_net [get_bd_intf_pins axis_subset_converter_0/M_AXIS] [get_bd_intf_pins v_frmbuf_wr_0/s_axis_video]
connect_bd_intf_net [get_bd_intf_pins v_vid_in_axi4s_0/video_out] [get_bd_intf_pins axis_subset_converter_0/S_AXIS]
connect_bd_intf_net [get_bd_intf_pins axi_interconnect_0/S00_AXI] [get_bd_intf_pins v_frmbuf_wr_0/m_axi_mm_video]
connect_bd_intf_net [get_bd_intf_pins S_AXI] [get_bd_intf_pins axi_gpio_0/S_AXI]
connect_bd_intf_net [get_bd_intf_pins s_axi_CTRL] [get_bd_intf_pins v_frmbuf_wr_0/s_axi_CTRL]
connect_bd_intf_net [get_bd_intf_pins M00_AXI] [get_bd_intf_pins axi_interconnect_0/M00_AXI]
connect_bd_net [get_bd_pins ACLK1] \
  [get_bd_pins axi_interconnect_0/ACLK] [get_bd_pins axi_interconnect_0/M00_ACLK] [get_bd_pins axi_interconnect_0/S00_ACLK] \
  [get_bd_pins rst_ps7_0_153M/slowest_sync_clk] [get_bd_pins v_frmbuf_wr_0/ap_clk] [get_bd_pins v_vid_in_axi4s_0/aclk] \
  [get_bd_pins axis_subset_converter_0/aclk]
connect_bd_net [get_bd_pins Din] [get_bd_pins xlslice_0/Din]
connect_bd_net [get_bd_pins ext_reset_in] [get_bd_pins rst_ps7_0_153M/ext_reset_in]
connect_bd_net [get_bd_pins rst_ps7_0_153M/peripheral_aresetn] \
  [get_bd_pins peripheral_aresetn] [get_bd_pins axi_interconnect_0/ARESETN] [get_bd_pins axi_interconnect_0/M00_ARESETN] \
  [get_bd_pins axi_interconnect_0/S00_ARESETN] [get_bd_pins v_vid_in_axi4s_0/aresetn] \
  [get_bd_pins axis_subset_converter_0/aresetn]
connect_bd_net [get_bd_pins v_frmbuf_wr_0/interrupt] [get_bd_pins interrupt]
connect_bd_net [get_bd_pins xlslice_0/Dout] [get_bd_pins v_frmbuf_wr_0/ap_rst_n]
connect_bd_net [get_bd_pins s_axi_aclk] [get_bd_pins axi_gpio_0/s_axi_aclk]
connect_bd_net [get_bd_pins s_axi_aresetn] [get_bd_pins axi_gpio_0/s_axi_aresetn]
connect_bd_net [get_bd_pins cmos_data] [get_bd_pins ov5640_capture_data_0/cam_data]
connect_bd_net [get_bd_pins cmos_href] [get_bd_pins ov5640_capture_data_0/cam_href]
connect_bd_net [get_bd_pins cmos_pclk] [get_bd_pins ov5640_capture_data_0/cam_pclk]
connect_bd_net [get_bd_pins cmos_vsync] [get_bd_pins ov5640_capture_data_0/cam_vsync]
connect_bd_net [get_bd_pins ov5640_capture_data_0/cmos_frame_clk] [get_bd_pins v_vid_in_axi4s_0/vid_io_in_clk]
connect_bd_net [get_bd_pins ov5640_capture_data_0/cmos_frame_ce] [get_bd_pins v_vid_in_axi4s_0/vid_io_in_ce]
connect_bd_net -net axi_gpio_1_gpio_io_o [get_bd_pins axi_gpio_0/gpio_io_o] [get_bd_pins ov5640_capture_data_0/rst_n]
connect_bd_net [get_bd_pins ov5640_capture_data_0/data_ready] [get_bd_pins util_vector_logic_0/Op1]
connect_bd_net [get_bd_pins util_vector_logic_0/Res] [get_bd_pins v_vid_in_axi4s_0/vid_io_in_reset]

current_bd_instance /hdmi_out
connect_bd_intf_net [get_bd_intf_pins S_AXI_LITE] [get_bd_intf_pins v_frmbuf_rd_0/s_axi_CTRL]
connect_bd_intf_net [get_bd_intf_pins tmds] [get_bd_intf_pins DVI_Transmitter_0/TMDS]
connect_bd_intf_net [get_bd_intf_pins axis_subset_converter_0/M_AXIS] [get_bd_intf_pins v_axi4s_vid_out_1/video_in]
connect_bd_intf_net [get_bd_intf_pins axi_interconnect_0/S00_AXI] [get_bd_intf_pins v_frmbuf_rd_0/m_axi_mm_video]
connect_bd_intf_net [get_bd_intf_pins s00_axi] [get_bd_intf_pins clk_wiz_dyn/s_axi_lite]
connect_bd_intf_net [get_bd_intf_pins axis_subset_converter_0/S_AXIS] [get_bd_intf_pins v_frmbuf_rd_0/m_axis_video]
connect_bd_intf_net [get_bd_intf_pins hdmi_vtc/vtiming_out] [get_bd_intf_pins v_axi4s_vid_out_1/vtiming_in]
connect_bd_intf_net [get_bd_intf_pins DVI_Transmitter_0/Video_In] [get_bd_intf_pins v_axi4s_vid_out_1/vid_io_out]
connect_bd_intf_net [get_bd_intf_pins M00_AXI] [get_bd_intf_pins axi_interconnect_0/M00_AXI]
connect_bd_intf_net [get_bd_intf_pins ctrl] [get_bd_intf_pins hdmi_vtc/ctrl]
connect_bd_net [get_bd_pins Din] [get_bd_pins xlslice_0/Din]
connect_bd_net -net clk_wiz_0_hdmi_pclk_5x [get_bd_pins clk_wiz_dyn/hdmi_pclk_5x] [get_bd_pins DVI_Transmitter_0/pclk_x5]
connect_bd_net -net clk_wiz_0_locked [get_bd_pins clk_wiz_dyn/locked] [get_bd_pins rst_hdmi_dynclk/dcm_locked]
connect_bd_net [get_bd_pins ext_reset_in] [get_bd_pins rst_hdmi_dynclk/ext_reset_in]
connect_bd_net -net hdmi_dynclk_PXL_CLK_O [get_bd_pins clk_wiz_dyn/hdmi_pclk] \
  [get_bd_pins hdmi_pclk] [get_bd_pins DVI_Transmitter_0/pclk] [get_bd_pins axi_interconnect_0/M00_ACLK] \
  [get_bd_pins axi_interconnect_0/S00_ACLK] [get_bd_pins axis_subset_converter_0/aclk] [get_bd_pins hdmi_vtc/clk] \
  [get_bd_pins rst_hdmi_dynclk/slowest_sync_clk] [get_bd_pins v_axi4s_vid_out_1/aclk] [get_bd_pins v_frmbuf_rd_0/ap_clk] \
  [get_bd_pins axi_interconnect_0/ACLK]
connect_bd_net [get_bd_pins hdmi_vtc/irq] [get_bd_pins irq]
connect_bd_net -net processing_system7_0_FCLK_CLK0 [get_bd_pins s00_axi_aclk] \
  [get_bd_pins clk_wiz_dyn/clk_in1] [get_bd_pins clk_wiz_dyn/s_axi_aclk] [get_bd_pins hdmi_vtc/s_axi_aclk]
connect_bd_net -net rst_hdmi_dynclk_100M_peripheral_aresetn [get_bd_pins rst_hdmi_dynclk/peripheral_aresetn] \
  [get_bd_pins peripheral_aresetn] [get_bd_pins DVI_Transmitter_0/reset_n] [get_bd_pins axi_interconnect_0/M00_ARESETN] \
  [get_bd_pins axi_interconnect_0/S00_ARESETN] [get_bd_pins axis_subset_converter_0/aresetn] \
  [get_bd_pins v_axi4s_vid_out_1/aresetn] [get_bd_pins axi_interconnect_0/ARESETN]
connect_bd_net -net rst_ps7_0_100M_peripheral_aresetn [get_bd_pins s00_axi_aresetn] \
  [get_bd_pins clk_wiz_dyn/s_axi_aresetn] [get_bd_pins hdmi_vtc/s_axi_aresetn]
connect_bd_net [get_bd_pins v_axi4s_vid_out_1/vtg_ce] [get_bd_pins hdmi_vtc/gen_clken]
connect_bd_net [get_bd_pins v_frmbuf_rd_0/interrupt] [get_bd_pins interrupt]
connect_bd_net [get_bd_pins xlslice_0/Dout] [get_bd_pins rst_hdmi_dynclk/aux_reset_in] [get_bd_pins v_frmbuf_rd_0/ap_rst_n]

current_bd_instance /lcd_out
connect_bd_intf_net [get_bd_intf_pins S_DMA_AXI] [get_bd_intf_pins axi_mem_intercon/S01_AXI]
connect_bd_intf_net [get_bd_intf_pins PWM_AXI] [get_bd_intf_pins lcd_pl_pwm/PWM_AXI]
connect_bd_intf_net [get_bd_intf_pins S_AXI] [get_bd_intf_pins lcd_id/S_AXI]
connect_bd_intf_net -intf_net rgb2lcd_1_lcd_rgb [get_bd_intf_pins lcd_rgb] [get_bd_intf_pins rgb2lcd/lcd_rgb]
connect_bd_intf_net [get_bd_intf_pins s_axi_CTRL] [get_bd_intf_pins v_frmbuf_rd_0/s_axi_CTRL]
connect_bd_intf_net [get_bd_intf_pins rgb2lcd/vid_rgb] [get_bd_intf_pins v_axi4s_vid_out_0/vid_io_out]
connect_bd_intf_net [get_bd_intf_pins axis_subset_converter_0/M_AXIS] [get_bd_intf_pins v_axi4s_vid_out_0/video_in]
connect_bd_intf_net [get_bd_intf_pins v_frmbuf_rd_0/m_axis_video] [get_bd_intf_pins axis_subset_converter_0/S_AXIS]
connect_bd_intf_net [get_bd_intf_pins ctrl] [get_bd_intf_pins lcd_vtc/ctrl]
connect_bd_intf_net [get_bd_intf_pins M00_AXI] [get_bd_intf_pins axi_mem_intercon/M00_AXI]
connect_bd_intf_net [get_bd_intf_pins axi_mem_intercon/S00_AXI] [get_bd_intf_pins v_frmbuf_rd_0/m_axi_mm_video]
connect_bd_intf_net [get_bd_intf_pins lcd_vtc/vtiming_out] [get_bd_intf_pins v_axi4s_vid_out_0/vtiming_in]
connect_bd_intf_net -intf_net gpio1_GPIO [get_bd_intf_pins lcd_id/GPIO] [get_bd_intf_pins rgb2lcd/lcd_id]
connect_bd_intf_net -intf_net rgb2lcd_1_lcd [get_bd_intf_pins lcd] [get_bd_intf_pins rgb2lcd/lcd]
connect_bd_net [get_bd_pins Din] [get_bd_pins xlslice_0/Din]
connect_bd_net -net ap_rst_n_1 [get_bd_pins proc_sys_reset_0/peripheral_aresetn] \
  [get_bd_pins lcd_rst] [get_bd_pins axi_mem_intercon/ARESETN] [get_bd_pins axi_mem_intercon/M00_ARESETN] \
  [get_bd_pins axi_mem_intercon/S00_ARESETN] [get_bd_pins v_axi4s_vid_out_0/aresetn] \
  [get_bd_pins axis_subset_converter_0/aresetn]
connect_bd_net -net clk_wiz_0_clk_out1 [get_bd_pins vid_io_out_clk] \
  [get_bd_pins axi_mem_intercon/ACLK] [get_bd_pins axi_mem_intercon/M00_ACLK] [get_bd_pins axi_mem_intercon/S00_ACLK] \
  [get_bd_pins lcd_vtc/clk] [get_bd_pins proc_sys_reset_0/slowest_sync_clk] [get_bd_pins rgb2lcd/pixel_clk] \
  [get_bd_pins v_axi4s_vid_out_0/aclk] [get_bd_pins v_frmbuf_rd_0/ap_clk] [get_bd_pins axis_subset_converter_0/aclk]
connect_bd_net [get_bd_pins ext_reset_in] [get_bd_pins proc_sys_reset_0/ext_reset_in]
connect_bd_net [get_bd_pins lcd_vtc/irq] [get_bd_pins irq]
connect_bd_net [get_bd_pins proc_sys_reset_0/interconnect_aresetn] [get_bd_pins interconnect_aresetn]
connect_bd_net -net processing_system7_0_FCLK_CLK0 [get_bd_pins pwm_axi_aclk] \
  [get_bd_pins lcd_id/s_axi_aclk] [get_bd_pins lcd_pl_pwm/pwm_axi_aclk] [get_bd_pins lcd_vtc/s_axi_aclk]
connect_bd_net -net pwm_0_pwm [get_bd_pins lcd_pl_pwm/pwm] [get_bd_pins lcd_bl]
connect_bd_net -net rst_ps7_0_100M_peripheral_aresetn [get_bd_pins pwm_axi_aresetn] \
  [get_bd_pins lcd_id/s_axi_aresetn] [get_bd_pins lcd_pl_pwm/pwm_axi_aresetn] [get_bd_pins lcd_vtc/s_axi_aresetn]
connect_bd_net [get_bd_pins v_axi4s_vid_out_0/vtg_ce] [get_bd_pins lcd_vtc/gen_clken]
connect_bd_net [get_bd_pins v_frmbuf_rd_0/interrupt] [get_bd_pins interrupt]
connect_bd_net [get_bd_pins xlslice_0/Dout] [get_bd_pins proc_sys_reset_0/aux_reset_in] [get_bd_pins v_frmbuf_rd_0/ap_rst_n]
connect_bd_net [get_bd_pins dma_aclk] [get_bd_pins axi_mem_intercon/S01_ACLK]
connect_bd_net [get_bd_pins dma_aresetn] [get_bd_pins axi_mem_intercon/S01_ARESETN]

current_bd_instance /
connect_bd_intf_net [get_bd_intf_pins axi_dma_0/M_AXI_S2MM] [get_bd_intf_pins lcd_out/S_DMA_AXI]
connect_bd_intf_net [get_bd_intf_pins audio/M00_AXI] [get_bd_intf_pins processing_system7_0/S_AXI_HP3]
connect_bd_intf_net [get_bd_intf_ports can0] [get_bd_intf_pins processing_system7_0/CAN_0]
connect_bd_intf_net [get_bd_intf_ports FIXED_IO] [get_bd_intf_pins processing_system7_0/FIXED_IO]
connect_bd_intf_net -intf_net rgb2lcd_1_lcd [get_bd_intf_ports lcd] [get_bd_intf_pins lcd_out/lcd]
connect_bd_intf_net [get_bd_intf_pins camera_in/M00_AXI] [get_bd_intf_pins processing_system7_0/S_AXI_HP2]
connect_bd_intf_net [get_bd_intf_ports i2c0] [get_bd_intf_pins processing_system7_0/IIC_0]
connect_bd_intf_net [get_bd_intf_pins hdmi_out/M00_AXI] [get_bd_intf_pins processing_system7_0/S_AXI_HP1]
connect_bd_intf_net [get_bd_intf_pins audio/s_axi_ctrl] [get_bd_intf_pins ps7_0_axi_periph/M10_AXI]
connect_bd_intf_net [get_bd_intf_ports pl_led] [get_bd_intf_pins axi_gpio_0/GPIO]
connect_bd_intf_net [get_bd_intf_pins ps7_0_axi_periph/M15_AXI] [get_bd_intf_pins camera_in/S_AXI]
connect_bd_intf_net [get_bd_intf_ports i2c2] [get_bd_intf_pins i2c2/IIC]
connect_bd_intf_net [get_bd_intf_ports i2c1] [get_bd_intf_pins processing_system7_0/IIC_1]
connect_bd_intf_net [get_bd_intf_pins lcd_out/S_AXI] [get_bd_intf_pins ps7_0_axi_periph/M00_AXI]
connect_bd_intf_net [get_bd_intf_pins lcd_out/ctrl] [get_bd_intf_pins ps7_0_axi_periph/M02_AXI]
connect_bd_intf_net [get_bd_intf_ports DDR] [get_bd_intf_pins processing_system7_0/DDR]
connect_bd_intf_net [get_bd_intf_pins gmii2rgmii_0/GMII] [get_bd_intf_pins processing_system7_0/GMII_ETHERNET_1]
connect_bd_intf_net [get_bd_intf_pins lcd_out/M00_AXI] [get_bd_intf_pins processing_system7_0/S_AXI_HP0]
connect_bd_intf_net [get_bd_intf_pins audio/s_axi_lite] [get_bd_intf_pins ps7_0_axi_periph/M09_AXI]
connect_bd_intf_net [get_bd_intf_pins hdmi_out/S_AXI_LITE] [get_bd_intf_pins ps7_0_axi_periph/M14_AXI]
connect_bd_intf_net [get_bd_intf_pins hdmi_out/s00_axi] [get_bd_intf_pins ps7_0_axi_periph/M12_AXI]
connect_bd_intf_net [get_bd_intf_pins camera_in/s_axi_CTRL] [get_bd_intf_pins ps7_0_axi_periph/M05_AXI]
connect_bd_intf_net [get_bd_intf_pins hdmi_out/ctrl] [get_bd_intf_pins ps7_0_axi_periph/M13_AXI]
connect_bd_intf_net [get_bd_intf_ports uart1] [get_bd_intf_pins processing_system7_0/UART_1]
connect_bd_intf_net -intf_net rgb2lcd_1_lcd_rgb [get_bd_intf_ports lcd_rgb] [get_bd_intf_pins lcd_out/lcd_rgb]
connect_bd_intf_net -intf_net DVI_Transmitter_0_TMDS [get_bd_intf_ports tmds] [get_bd_intf_pins hdmi_out/tmds]
connect_bd_intf_net [get_bd_intf_pins lcd_out/PWM_AXI] [get_bd_intf_pins ps7_0_axi_periph/M01_AXI]
connect_bd_intf_net [get_bd_intf_pins lcd_out/s_axi_CTRL] [get_bd_intf_pins ps7_0_axi_periph/M03_AXI]
connect_bd_intf_net [get_bd_intf_ports gpio0] [get_bd_intf_pins processing_system7_0/GPIO_0]
connect_bd_intf_net [get_bd_intf_pins ps7_0_axi_periph/M08_AXI] [get_bd_intf_pins rest_gpio/S_AXI]
connect_bd_intf_net [get_bd_intf_ports rgmii] [get_bd_intf_pins gmii2rgmii_0/RGMII]
connect_bd_intf_net [get_bd_intf_pins i2c2/S_AXI] [get_bd_intf_pins ps7_0_axi_periph/M07_AXI]
connect_bd_intf_net [get_bd_intf_pins axi_gpio_0/S_AXI] [get_bd_intf_pins ps7_0_axi_periph/M06_AXI]
connect_bd_intf_net [get_bd_intf_pins clk_wiz_0/s_axi_lite] [get_bd_intf_pins ps7_0_axi_periph/M04_AXI]
connect_bd_intf_net [get_bd_intf_pins processing_system7_0/M_AXI_GP0] [get_bd_intf_pins ps7_0_axi_periph/S00_AXI]
connect_bd_intf_net [get_bd_intf_ports mdio] [get_bd_intf_pins processing_system7_0/MDIO_ETHERNET_1]
connect_bd_intf_net [get_bd_intf_pins audio/s_axi_ctrl1] [get_bd_intf_pins ps7_0_axi_periph/M11_AXI]
connect_bd_intf_net [get_bd_intf_pins stream_gen_0/m_axis] [get_bd_intf_pins axi_dma_0/S_AXIS_S2MM]
connect_bd_intf_net [get_bd_intf_pins processing_system7_0/M_AXI_GP1] [get_bd_intf_pins dma_ctrl_intercon/S00_AXI]
connect_bd_intf_net [get_bd_intf_pins dma_ctrl_intercon/M00_AXI] [get_bd_intf_pins axi_dma_0/S_AXI_LITE]
connect_bd_intf_net [get_bd_intf_pins dma_ctrl_intercon/M01_AXI] [get_bd_intf_pins stream_gen_0/s_axi]
connect_bd_net -net M03_ARESETN_1 [get_bd_pins lcd_out/interconnect_aresetn] [get_bd_pins ps7_0_axi_periph/M03_ARESETN]
connect_bd_net -net audio_formatter_irq_mm2s [get_bd_pins audio/irq_mm2s] [get_bd_pins xlconcat_0/In7]
connect_bd_net -net audio_formatter_irq_s2mm [get_bd_pins audio/irq_s2mm] [get_bd_pins xlconcat_0/In4]
connect_bd_net -net cam_data_0_1 [get_bd_ports cmos_data] [get_bd_pins camera_in/cmos_data]
connect_bd_net -net cam_href_0_1 [get_bd_ports cmos_href] [get_bd_pins camera_in/cmos_href]
connect_bd_net -net cam_pclk_0_1 [get_bd_ports cmos_pclk] [get_bd_pins camera_in/cmos_pclk]
connect_bd_net -net cam_vsync_0_1 [get_bd_ports cmos_vsync] [get_bd_pins camera_in/cmos_vsync]
connect_bd_net [get_bd_pins camera_in/interrupt] [get_bd_pins xlconcat_0/In2]
connect_bd_net -net clk_wiz_0_clk_out1 [get_bd_pins clk_wiz_0/lcd_pclk] \
  [get_bd_pins lcd_out/vid_io_out_clk] [get_bd_pins processing_system7_0/S_AXI_HP0_ACLK] \
  [get_bd_pins ps7_0_axi_periph/M03_ACLK]
connect_bd_net [get_bd_pins clk_wiz_0/locked] [get_bd_pins audio/dcm_locked]
connect_bd_net [get_bd_pins clk_wiz_0/mclk] [get_bd_pins audio/aud_mclk] [get_bd_ports aud_mclk]
connect_bd_net [get_bd_pins hdmi_out/hdmi_pclk] [get_bd_pins processing_system7_0/S_AXI_HP1_ACLK] [get_bd_pins ps7_0_axi_periph/M14_ACLK]
connect_bd_net [get_bd_pins hdmi_out/interrupt] [get_bd_pins xlconcat_0/In8]
connect_bd_net [get_bd_pins hdmi_out/irq] [get_bd_pins xlconcat_0/In9]
connect_bd_net [get_bd_pins hdmi_out/peripheral_aresetn] [get_bd_pins ps7_0_axi_periph/M14_ARESETN]
connect_bd_net [get_bd_pins i2c2/iic2intc_irpt] [get_bd_pins xlconcat_0/In3]
connect_bd_net -net i2s_receiver_irq [get_bd_pins audio/irq] [get_bd_pins xlconcat_0/In6]
connect_bd_net -net i2s_receiver_lrclk_out [get_bd_pins audio/aud_adclrc] [get_bd_ports aud_adclrc]
connect_bd_net -net i2s_transmitter_irq [get_bd_pins audio/irq1] [get_bd_pins xlconcat_0/In5]
connect_bd_net -net i2s_transmitter_lrclk_out [get_bd_pins audio/aud_daclrc] [get_bd_ports aud_daclrc]
connect_bd_net -net i2s_transmitter_sclk_out [get_bd_pins audio/aud_bclk] [get_bd_ports aud_bclk]
connect_bd_net -net i2s_transmitter_sdata_0_out [get_bd_pins audio/aud_dacdat] [get_bd_ports aud_dacdat]
connect_bd_net [get_bd_pins lcd_out/interrupt] [get_bd_pins xlconcat_0/In0]
connect_bd_net [get_bd_pins lcd_out/irq] [get_bd_pins xlconcat_0/In1]
connect_bd_net [get_bd_pins lcd_out/lcd_rst] [get_bd_ports lcd_rst]
connect_bd_net [get_bd_pins processing_system7_0/FCLK_CLK0] \
  [get_bd_pins audio/s_axi_ctrl_aclk] [get_bd_pins axi_gpio_0/s_axi_aclk] [get_bd_pins clk_wiz_0/clk_in1] \
  [get_bd_pins clk_wiz_0/s_axi_aclk] [get_bd_pins hdmi_out/s00_axi_aclk] [get_bd_pins i2c2/s_axi_aclk] \
  [get_bd_pins lcd_out/pwm_axi_aclk] [get_bd_pins processing_system7_0/M_AXI_GP0_ACLK] \
  [get_bd_pins processing_system7_0/S_AXI_HP3_ACLK] [get_bd_pins ps7_0_axi_periph/ACLK] \
  [get_bd_pins ps7_0_axi_periph/M00_ACLK] [get_bd_pins ps7_0_axi_periph/M01_ACLK] [get_bd_pins ps7_0_axi_periph/M02_ACLK] \
  [get_bd_pins ps7_0_axi_periph/M04_ACLK] [get_bd_pins ps7_0_axi_periph/M06_ACLK] [get_bd_pins ps7_0_axi_periph/M07_ACLK] \
  [get_bd_pins ps7_0_axi_periph/M08_ACLK] [get_bd_pins ps7_0_axi_periph/M09_ACLK] [get_bd_pins ps7_0_axi_periph/M10_ACLK] \
  [get_bd_pins ps7_0_axi_periph/M11_ACLK] [get_bd_pins ps7_0_axi_periph/M12_ACLK] [get_bd_pins ps7_0_axi_periph/M13_ACLK] \
  [get_bd_pins ps7_0_axi_periph/S00_ACLK] [get_bd_pins rest_gpio/s_axi_aclk] [get_bd_pins rst_ps7_0_100M/slowest_sync_clk] \
  [get_bd_pins camera_in/s_axi_aclk] [get_bd_pins ps7_0_axi_periph/M15_ACLK] [get_bd_pins lcd_out/dma_aclk] \
  [get_bd_pins axi_dma_0/m_axi_s2mm_aclk] [get_bd_pins axi_dma_0/s_axi_lite_aclk] [get_bd_pins stream_gen_0/s_axi_aclk] \
  [get_bd_pins processing_system7_0/M_AXI_GP1_ACLK] [get_bd_pins dma_ctrl_intercon/ACLK] \
  [get_bd_pins dma_ctrl_intercon/S00_ACLK] [get_bd_pins dma_ctrl_intercon/M00_ACLK] [get_bd_pins dma_ctrl_intercon/M01_ACLK]
connect_bd_net [get_bd_pins processing_system7_0/FCLK_CLK1] \
  [get_bd_pins camera_in/ACLK1] [get_bd_pins processing_system7_0/S_AXI_HP2_ACLK] [get_bd_pins ps7_0_axi_periph/M05_ACLK]
connect_bd_net [get_bd_pins processing_system7_0/FCLK_CLK2] [get_bd_pins gmii2rgmii_0/idelay_clk]
connect_bd_net [get_bd_pins processing_system7_0/FCLK_RESET0_N] \
  [get_bd_pins camera_in/ext_reset_in] [get_bd_pins hdmi_out/ext_reset_in] [get_bd_pins rst_ps7_0_100M/ext_reset_in]
connect_bd_net -net pwm_0_pwm [get_bd_pins lcd_out/lcd_bl] [get_bd_ports lcd_bl]
connect_bd_net [get_bd_pins rest_gpio/gpio_io_o] [get_bd_pins camera_in/Din] [get_bd_pins hdmi_out/Din] [get_bd_pins lcd_out/Din]
connect_bd_net [get_bd_pins rst_ps7_0_100M/peripheral_aresetn] \
  [get_bd_pins audio/s_axi_ctrl_aresetn] [get_bd_pins axi_gpio_0/s_axi_aresetn] [get_bd_pins clk_wiz_0/s_axi_aresetn] \
  [get_bd_pins hdmi_out/s00_axi_aresetn] [get_bd_pins i2c2/s_axi_aresetn] [get_bd_pins lcd_out/pwm_axi_aresetn] \
  [get_bd_pins ps7_0_axi_periph/ARESETN] [get_bd_pins ps7_0_axi_periph/M00_ARESETN] \
  [get_bd_pins ps7_0_axi_periph/M01_ARESETN] [get_bd_pins ps7_0_axi_periph/M02_ARESETN] \
  [get_bd_pins ps7_0_axi_periph/M04_ARESETN] [get_bd_pins ps7_0_axi_periph/M06_ARESETN] \
  [get_bd_pins ps7_0_axi_periph/M07_ARESETN] [get_bd_pins ps7_0_axi_periph/M08_ARESETN] \
  [get_bd_pins ps7_0_axi_periph/M09_ARESETN] [get_bd_pins ps7_0_axi_periph/M10_ARESETN] \
  [get_bd_pins ps7_0_axi_periph/M11_ARESETN] [get_bd_pins ps7_0_axi_periph/M12_ARESETN] \
  [get_bd_pins ps7_0_axi_periph/M13_ARESETN] [get_bd_pins ps7_0_axi_periph/S00_ARESETN] [get_bd_pins rest_gpio/s_axi_aresetn] \
  [get_bd_pins lcd_out/ext_reset_in] [get_bd_pins camera_in/s_axi_aresetn] [get_bd_pins ps7_0_axi_periph/M15_ARESETN] \
  [get_bd_pins lcd_out/dma_aresetn] [get_bd_pins axi_dma_0/axi_resetn] [get_bd_pins stream_gen_0/s_axi_aresetn] \
  [get_bd_pins dma_ctrl_intercon/S00_ARESETN] [get_bd_pins dma_ctrl_intercon/M00_ARESETN] \
  [get_bd_pins dma_ctrl_intercon/M01_ARESETN]
connect_bd_net -net rst_ps7_0_153M_peripheral_aresetn [get_bd_pins camera_in/peripheral_aresetn] [get_bd_pins ps7_0_axi_periph/M05_ARESETN]
connect_bd_net -net sdata_0_in_0_1 [get_bd_ports aud_adcdat] [get_bd_pins audio/aud_adcdat]
connect_bd_net [get_bd_pins xlconcat_0/dout] [get_bd_pins processing_system7_0/IRQ_F2P]
connect_bd_net [get_bd_pins rst_ps7_0_100M/interconnect_aresetn] [get_bd_pins dma_ctrl_intercon/ARESETN]
connect_bd_net [get_bd_pins axi_dma_0/s2mm_introut] [get_bd_pins xlconcat_0/In10]

# ---- address map ----
assign_bd_address -offset 0x00000000 -range 1G -target_address_space [get_bd_addr_spaces audio/audio_formatter/m_axi_mm2s] [get_bd_addr_segs processing_system7_0/S_AXI_HP3/HP3_DDR_LOWOCM]
assign_bd_address -offset 0x00000000 -range 1G -target_address_space [get_bd_addr_spaces audio/audio_formatter/m_axi_s2mm] [get_bd_addr_segs processing_system7_0/S_AXI_HP3/HP3_DDR_LOWOCM]
assign_bd_address -offset 0x00000000 -range 1G -target_address_space [get_bd_addr_spaces axi_dma_0/Data_S2MM] [get_bd_addr_segs processing_system7_0/S_AXI_HP0/HP0_DDR_LOWOCM]
assign_bd_address -offset 0x00000000 -range 1G -target_address_space [get_bd_addr_spaces camera_in/v_frmbuf_wr_0/Data_m_axi_mm_video] [get_bd_addr_segs processing_system7_0/S_AXI_HP2/HP2_DDR_LOWOCM]
assign_bd_address -offset 0x00000000 -range 1G -target_address_space [get_bd_addr_spaces hdmi_out/v_frmbuf_rd_0/Data_m_axi_mm_video] [get_bd_addr_segs processing_system7_0/S_AXI_HP1/HP1_DDR_LOWOCM]
assign_bd_address -offset 0x00000000 -range 1G -target_address_space [get_bd_addr_spaces lcd_out/v_frmbuf_rd_0/Data_m_axi_mm_video] [get_bd_addr_segs processing_system7_0/S_AXI_HP0/HP0_DDR_LOWOCM]
assign_bd_address -offset 0x41200000 -range 64K -target_address_space [get_bd_addr_spaces processing_system7_0/Data] [get_bd_addr_segs lcd_out/lcd_id/S_AXI/Reg]
assign_bd_address -offset 0x41210000 -range 64K -target_address_space [get_bd_addr_spaces processing_system7_0/Data] [get_bd_addr_segs axi_gpio_0/S_AXI/Reg]
assign_bd_address -offset 0x41220000 -range 64K -target_address_space [get_bd_addr_spaces processing_system7_0/Data] [get_bd_addr_segs rest_gpio/S_AXI/Reg]
assign_bd_address -offset 0x41230000 -range 64K -target_address_space [get_bd_addr_spaces processing_system7_0/Data] [get_bd_addr_segs camera_in/axi_gpio_0/S_AXI/Reg]
assign_bd_address -offset 0x41600000 -range 64K -target_address_space [get_bd_addr_spaces processing_system7_0/Data] [get_bd_addr_segs i2c2/S_AXI/Reg]
assign_bd_address -offset 0x43C00000 -range 64K -target_address_space [get_bd_addr_spaces processing_system7_0/Data] [get_bd_addr_segs lcd_out/lcd_pl_pwm/PWM_AXI/PWM_AXI_reg]
assign_bd_address -offset 0x43C10000 -range 64K -target_address_space [get_bd_addr_spaces processing_system7_0/Data] [get_bd_addr_segs lcd_out/lcd_vtc/ctrl/Reg]
assign_bd_address -offset 0x43C20000 -range 64K -target_address_space [get_bd_addr_spaces processing_system7_0/Data] [get_bd_addr_segs lcd_out/v_frmbuf_rd_0/s_axi_CTRL/Reg]
assign_bd_address -offset 0x43C30000 -range 64K -target_address_space [get_bd_addr_spaces processing_system7_0/Data] [get_bd_addr_segs clk_wiz_0/s_axi_lite/Reg]
assign_bd_address -offset 0x43C40000 -range 64K -target_address_space [get_bd_addr_spaces processing_system7_0/Data] [get_bd_addr_segs camera_in/v_frmbuf_wr_0/s_axi_CTRL/Reg]
assign_bd_address -offset 0x43C50000 -range 64K -target_address_space [get_bd_addr_spaces processing_system7_0/Data] [get_bd_addr_segs audio/audio_formatter/s_axi_lite/reg0]
assign_bd_address -offset 0x43C60000 -range 64K -target_address_space [get_bd_addr_spaces processing_system7_0/Data] [get_bd_addr_segs audio/i2s_receiver/s_axi_ctrl/Reg]
assign_bd_address -offset 0x43C70000 -range 64K -target_address_space [get_bd_addr_spaces processing_system7_0/Data] [get_bd_addr_segs audio/i2s_transmitter/s_axi_ctrl/Reg]
assign_bd_address -offset 0x43C80000 -range 64K -target_address_space [get_bd_addr_spaces processing_system7_0/Data] [get_bd_addr_segs hdmi_out/clk_wiz_dyn/s_axi_lite/Reg]
assign_bd_address -offset 0x43C90000 -range 64K -target_address_space [get_bd_addr_spaces processing_system7_0/Data] [get_bd_addr_segs hdmi_out/hdmi_vtc/ctrl/Reg]
assign_bd_address -offset 0x43CA0000 -range 64K -target_address_space [get_bd_addr_spaces processing_system7_0/Data] [get_bd_addr_segs hdmi_out/v_frmbuf_rd_0/s_axi_CTRL/Reg]
assign_bd_address -offset 0x80400000 -range 64K -target_address_space [get_bd_addr_spaces processing_system7_0/Data] [get_bd_addr_segs axi_dma_0/S_AXI_LITE/Reg]
assign_bd_address -offset 0x83CB0000 -range 64K -target_address_space [get_bd_addr_spaces processing_system7_0/Data] [get_bd_addr_segs stream_gen_0/s_axi/reg0]

validate_bd_design
save_bd_design
